# Altium schematic sheet Mezclador1.SchDoc
size A4
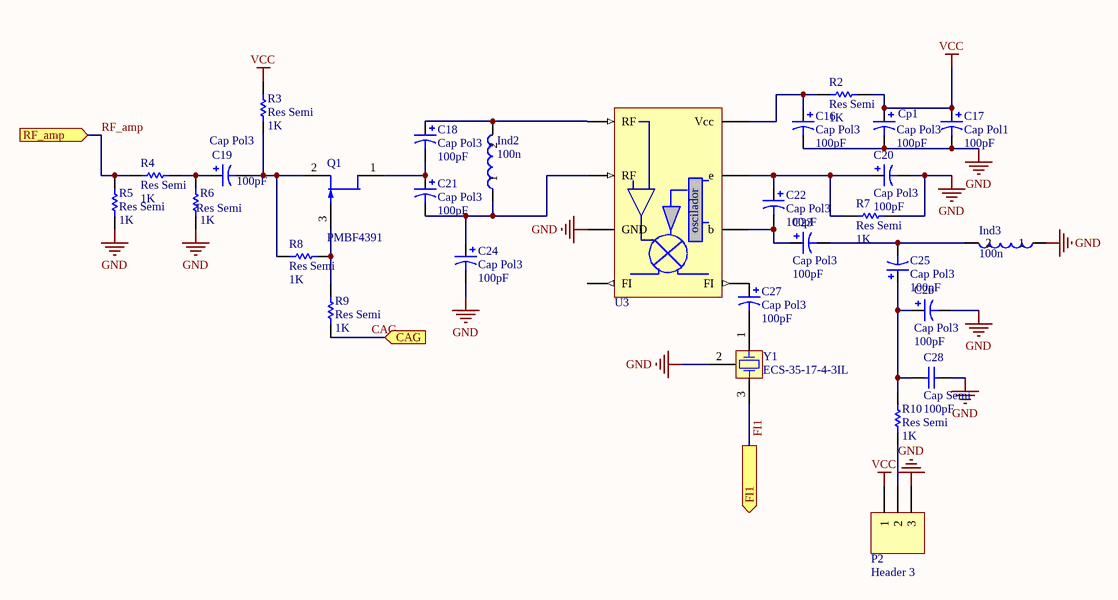
[diagram p0: Mezclador1.SchDoc]

## Parts
C16  Cap Pol3  value 100pF  [C0805]
C17  Cap Pol1  value 100pF  [B]
C18  Cap Pol3  value 100pF  [C0805]
C19  Cap Pol3  value 100pF  [C0805]
C20  Cap Pol3  value 100pF  [C0805]
C21  Cap Pol3  value 100pF  [C0805]
C22  Cap Pol3  value 100pF  [C0805]
C23  Cap Pol3  value 100pF  [C0805]
C24  Cap Pol3  value 100pF  [C0805]
C25  Cap Pol3  value 100pF  [C0805]
C26  Cap Pol3  value 100pF  [C0805]
C27  Cap Pol3  value 100pF  [C0805]
C28  Cap Semi  value 100pF  [C1206]
Cp1  Cap Pol3  value 100pF  [C0805]
Ind2  Valor: 100n  [Ind_5mm]  (hidden comment: Ind2)
Ind3  Valor: 100n  [Ind_4mm]  (hidden comment: Ind2)
P2  Header 3  [HDR1X3]
Q1  PMBF4391  [SOT23_N]
R2  Res Semi  value 1K  [2012[0805]]
R3  Res Semi  value 1K  [2012[0805]]
R4  Res Semi  value 1K  [2012[0805]]
R5  Res Semi  value 1K  [2012[0805]]
R6  Res Semi  value 1K  [2012[0805]]
R7  Res Semi  value 1K  [2012[0805]]
R8  Res Semi  value 1K  [2012[0805]]
R9  Res Semi  value 1K  [2012[0805]]
R10  Res Semi  value 1K  [2012[0805]]
U3  SA602  [SA602]  (value not drawn)
Y1  ECS-35-17-4-3IL  [HC-49US]

## Ports
CAG (in), FI1 (out), RF_amp (in)

## Nets
GND: C16.2 C17.2 C20.2 C24.2 C26.2 C28.2 Cp1.2 Ind3.1 P2.3 R5.1 R6.1 R7.1 U3.3(GND) Y1.2(COM)
VCC: C17.1 Cp1.1 P2.1 R2.2 R3.2
CAG: R9.2 ; port CAG
FI1: Y1.3(OSC2) ; port FI1
RF_amp: R4.1 R5.2 ; port RF_amp
NetC16_1: C16.1 R2.1 U3.8(Vcc)
NetC18_1: C18.1 Ind2.2 U3.1(RF)
NetC18_2: C18.2 C21.1 Q1.1(D)
NetC19_1: C19.1 R4.2 R6.2
NetC19_2: C19.2 Q1.2(S) R3.1 R8.1
NetC20_1: C20.1 C22.1 R7.2 U3.7(e)
NetC21_2: C21.2 C24.1 Ind2.1 U3.2(RF)
NetC22_2: C22.2 C23.1 U3.6(b)
NetC23_2: C23.2 C25.2 Ind3.2
NetC25_1: C25.1 C26.1 C28.1 R10.2
NetC27_1: C27.1 U3.5(FI)
NetC27_2: C27.2 Y1.1(OSC1)
NetP2_2: P2.2 R10.1
NetQ1_3: Q1.3(G) R8.2 R9.1

Not connected (* = marked no-connect by the designer): U3 4(FI)

## Notes on the sheet
- (in symbol SA602A) oscilador

## Library data of the parts
C16 C18-C27 Cp1 = Cap Pol3: Polarized Capacitor (Surface Mount); Published: 8-Jun-2000; LatestRevisionDate: 17-Jul-2002; LatestRevisionNote: Re-released for DXP Platform.; PackageReference: C0805; Publisher: Altium Limited
C17 = Cap Pol1: Polarized Capacitor (Radial); Published: 8-Jun-2000; LatestRevisionDate: 17-Jul-2002; LatestRevisionNote: Re-released for DXP Platform.; PackageReference: RB7.6-15; Publisher: Altium Limited
C28 = Cap Semi: Capacitor (Semiconductor SIM Model); Published: 8-Jun-2000; LatestRevisionDate: 17-Jul-2002; LatestRevisionNote: Re-released for DXP Platform.; PackageReference: C1206; Publisher: Altium Limited
P2 = Header 3: Header, 3-Pin; LatestRevisionDate: 17-Jul-2002; LatestRevisionNote: Re-released for DXP Platform.; Publisher: Altium Limited
Q1 = PMBF4391: N-channel Silicon Junction Field-effect Transistor; Published: 17-Sep-2003; LatestRevisionDate: 12-Dec-2006; LatestRevisionNote: IPC-7351 Footprint Added.; DatasheetVersion: Apr-1995; PackageVersion: May-1999; PackageReference: SOT23; Publisher: Altium Limited; PackageDescription: 3-Pin SOT-23 Package 0.95 mm Pitch, 2.3 mm Lead Span; ComponentLink1Description: Manufacturer Link; ComponentLink1URL: http://www.semiconductors.philips.com/; ComponentLink2Description: Datasheet; ComponentLink2URL: http://www.semiconductors.philips.com/acrobat/datasheets/PMBF4391_4392_4393_CNV_2.pdf
R2-R10 = Res Semi: Semiconductor Resistor; Published: 8-Jun-2000; LatestRevisionDate: 17-Jul-2002; LatestRevisionNote: Re-released for DXP Platform.; PackageReference: AXIAL-0.5; Publisher: Altium Limited
U3 = SA602A: Mezclador 500MHz
Y1 = ECS-35-17-4-3IL: Crystal Oscillator, 3rd In-Line Lead Version; Published: 17-Jul-2002; DatasheetDocument: 18-Apr-2000; PackageReference: HC-49US; Publisher: Altium Limited; ComponentLink1Description: Manufacturer Link; ComponentLink1URL: http://www.ecsxtal.com/; ComponentLink2Description: Datasheet; ComponentLink2URL: http://www.ecsxtal.com/pdf3/HC_49US.pdf